# Altium schematic sheet MCU.SchDoc: Title
size A3; Project: Q24 VCU; ENG_APP_DATE: --/--/--; DSN_APP_DATE: --/--/--; CHK_APP_DATE: --/--/--; Date: *******; ApprovedBy: *******; CheckedBy: None; Author: *******; CompanyName: *******; DrawnBy: Jacob Chisholm; Engineer: *******; Organization: *******; Address1: *******; Address2: *******; Address3: *******; Address4: *******; DocumentNumber: 2; Revision: *******; SheetNumber: 2; SheetTotal: 14; Address_Website: https://jchisholm204.github.io; E-Mail: JacobChisholm1010@gmail.com; CurrentTime: *******; CurrentDate: *******; Time: *******; DocumentFullPathAndName: *******; DocumentName: *******; ModifiedDate: *******; ImagePath: *******; ProjectName: *******; Application_BuildNumber: *******
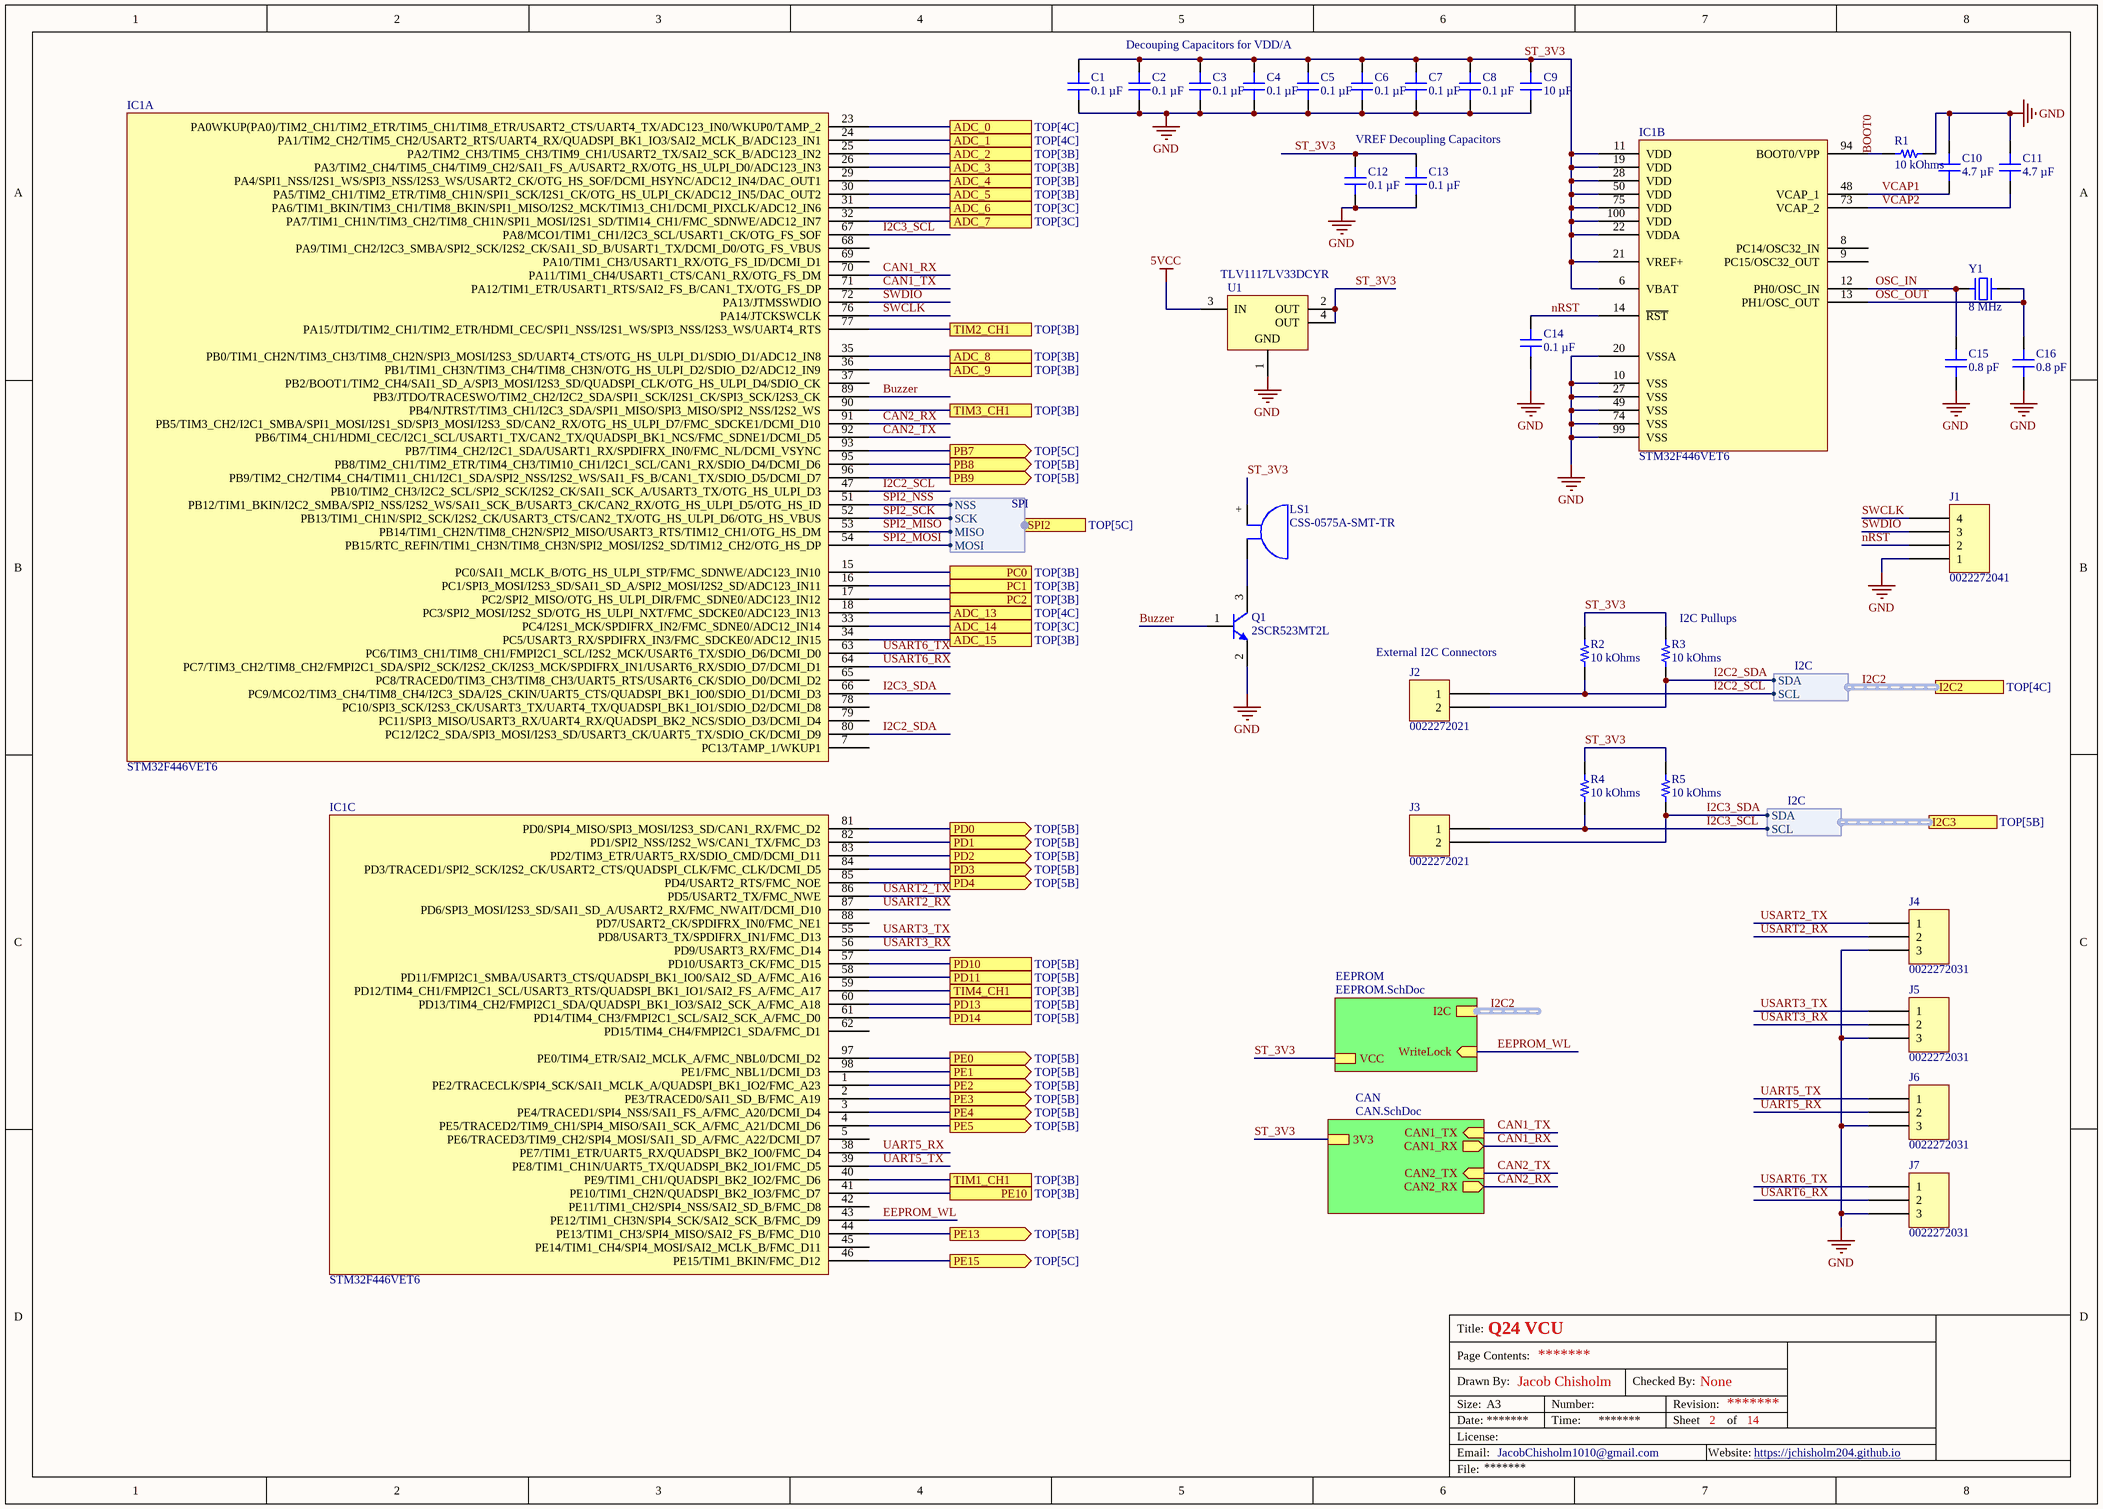
[diagram p0: MCU.SchDoc]

## Parts
C1  0.1 µF  [CAP 0603_1608]
C2  0.1 µF  [CAP 0603_1608]
C3  0.1 µF  [CAP 0603_1608]
C4  0.1 µF  [CAP 0603_1608]
C5  0.1 µF  [CAP 0603_1608]
C6  0.1 µF  [CAP 0603_1608]
C7  0.1 µF  [CAP 0603_1608]
C8  0.1 µF  [CAP 0603_1608]
C9  10 µF  [CAP 0603_1608]
C10  4.7 µF  [CAP 0603_1608]
C11  4.7 µF  [CAP 0603_1608]
C12  0.1 µF  [CAP 0603_1608]
C13  0.1 µF  [CAP 0603_1608]
C14  0.1 µF  [CAP 0603_1608]
C15  0.8 pF  [CAP 0603_1608]
C16  0.8 pF  [CAP 0603_1608]
IC1  STM32F446VET6  [ST LQFP-100 14X14MM]  (parts A,B,C of 3)
J1  0022272041  [MOLEX KK 0022272041]
J2  0022272021  [MOLEX KK 0022272021]
J3  0022272021  [MOLEX KK 0022272021]
J4  0022272031  [MOLEX KK 0022272031]
J5  0022272031  [MOLEX KK 0022272031]
J6  0022272031  [MOLEX KK 0022272031]
J7  0022272031  [MOLEX KK 0022272031]
LS1  CSS-0575A-SMT-TR  [CUI CSS-0575A-SMT-TR]
Q1  2SCR523MT2L  [ROHM SOT-723]
R1  10 kOhms  [RES 0603_1608]
R2  10 kOhms  [RES 0603_1608]
R3  10 kOhms  [RES 0603_1608]
R4  10 kOhms  [RES 0603_1608]
R5  10 kOhms  [RES 0603_1608]
U1  TLV1117LV33DCYR  [DCY0004A_N]
Y1  8 MHz  [NDK NX3225GD]

## Sub-sheets
CAN = CAN.SchDoc: CAN1_TX (in), CAN1_RX (out), CAN2_TX (in), CAN2_RX (out), 3V3
EEPROM = EEPROM.SchDoc: I2C (harness I2C), WriteLock (in), VCC

## Ports
ADC_0 (see TOP[4C]), ADC_1 (see TOP[4C]), ADC_2 (see TOP[3B]), ADC_3 (see TOP[3B]), ADC_4 (see TOP[3B]), ADC_5 (see TOP[3B]), ADC_6 (see TOP[3C]), ADC_7 (see TOP[3C]), ADC_8 (see TOP[3B]), ADC_9 (see TOP[3B]), ADC_13 (see TOP[4C]), ADC_14 (see TOP[3C]), ADC_15 (see TOP[3B]), I2C2 (harness I2C, see TOP[4C]), I2C3 (harness I2C, see TOP[5B]), PB7 (out, see TOP[5C]), PB8 (out, see TOP[5B]), PB9 (out, see TOP[5B]), PC0 (see TOP[3B]), PC1 (see TOP[3B]), PC2 (see TOP[3B]), PD0 (out, see TOP[5B]), PD1 (out, see TOP[5B]), PD2 (out, see TOP[5B]), PD3 (out, see TOP[5B]), PD4 (out, see TOP[5B]), PD10 (see TOP[5B]), PD11 (see TOP[5B]), PD13 (see TOP[5B]), PD14 (see TOP[5B]), PE0 (out, see TOP[5B]), PE1 (out, see TOP[5B]), PE2 (out, see TOP[5B]), PE3 (out, see TOP[5B]), PE4 (out, see TOP[5B]), PE5 (out, see TOP[5B]), PE10 (see TOP[3B]), PE13 (out, see TOP[5B]), PE15 (out, see TOP[5C]), SPI2 (harness SPI, see TOP[5C]), TIM1_CH1 (see TOP[3B]), TIM2_CH1 (see TOP[3B]), TIM3_CH1 (see TOP[3B]), TIM4_CH1 (see TOP[3B])

## Harnesses
SPI: NSS, SCK, MISO, MOSI
I2C: SDA, SCL

## Nets
5VCC: U1.3(IN)
GND: C1.1 C2.1 C3.1 C4.1 C5.1 C6.1 C7.1 C8.1 C9.1 C10.2 C11.2 C12.1 C13.1 C14.1 C15.1 C16.1 IC1.10(VSS) IC1.20(VSSA) IC1.27(VSS) IC1.49(VSS) IC1.74(VSS) IC1.99(VSS) J1.1 J4.3 J5.3 J6.3 J7.3 Q1.2(E) R1.2 U1.1(GND)
ADC_0: IC1.23(PA0WKUP(PA0)/TIM2_CH1/TIM2_ETR/TIM5_CH1/TIM8_ETR/USART2_CTS/UART4_TX/ADC123_IN0/WKUP0/TAMP_2) ; port ADC_0
ADC_1: IC1.24(PA1/TIM2_CH2/TIM5_CH2/USART2_RTS/UART4_RX/QUADSPI_BK1_IO3/SAI2_MCLK_B/ADC123_IN1) ; port ADC_1
ADC_2: IC1.25(PA2/TIM2_CH3/TIM5_CH3/TIM9_CH1/USART2_TX/SAI2_SCK_B/ADC123_IN2) ; port ADC_2
ADC_3: IC1.26(PA3/TIM2_CH4/TIM5_CH4/TIM9_CH2/SAI1_FS_A/USART2_RX/OTG_HS_ULPI_D0/ADC123_IN3) ; port ADC_3
ADC_4: IC1.29(PA4/SPI1_NSS/I2S1_WS/SPI3_NSS/I2S3_WS/USART2_CK/OTG_HS_SOF/DCMI_HSYNC/ADC12_IN4/DAC_OUT1) ; port ADC_4
ADC_5: IC1.30(PA5/TIM2_CH1/TIM2_ETR/TIM8_CH1N/SPI1_SCK/I2S1_CK/OTG_HS_ULPI_CK/ADC12_IN5/DAC_OUT2) ; port ADC_5
ADC_6: IC1.31(PA6/TIM1_BKIN/TIM3_CH1/TIM8_BKIN/SPI1_MISO/I2S2_MCK/TIM13_CH1/DCMI_PIXCLK/ADC12_IN6) ; port ADC_6
ADC_7: IC1.32(PA7/TIM1_CH1N/TIM3_CH2/TIM8_CH1N/SPI1_MOSI/I2S1_SD/TIM14_CH1/FMC_SDNWE/ADC12_IN7) ; port ADC_7
ADC_8: IC1.35(PB0/TIM1_CH2N/TIM3_CH3/TIM8_CH2N/SPI3_MOSI/I2S3_SD/UART4_CTS/OTG_HS_ULPI_D1/SDIO_D1/ADC12_IN8) ; port ADC_8
ADC_9: IC1.36(PB1/TIM1_CH3N/TIM3_CH4/TIM8_CH3N/OTG_HS_ULPI_D2/SDIO_D2/ADC12_IN9) ; port ADC_9
ADC_13: IC1.18(PC3/SPI2_MOSI/I2S2_SD/OTG_HS_ULPI_NXT/FMC_SDCKE0/ADC123_IN13) ; port ADC_13
ADC_14: IC1.33(PC4/I2S1_MCK/SPDIFRX_IN2/FMC_SDNE0/ADC12_IN14) ; port ADC_14
ADC_15: IC1.34(PC5/USART3_RX/SPDIFRX_IN3/FMC_SDCKE0/ADC12_IN15) ; port ADC_15
BOOT0: IC1.94(BOOT0/VPP) R1.1
Buzzer: IC1.89(PB3/JTDO/TRACESWO/TIM2_CH2/I2C2_SDA/SPI1_SCK/I2S1_CK/SPI3_SCK/I2S3_CK) Q1.1(B)
CAN1_RX: IC1.70(PA11/TIM1_CH4/USART1_CTS/CAN1_RX/OTG_FS_DM) ; sheet CAN/CAN1_RX
CAN1_TX: IC1.71(PA12/TIM1_ETR/USART1_RTS/SAI2_FS_B/CAN1_TX/OTG_FS_DP) ; sheet CAN/CAN1_TX
CAN2_RX: IC1.91(PB5/TIM3_CH2/I2C1_SMBA/SPI1_MOSI/I2S1_SD/SPI3_MOSI/I2S3_SD/CAN2_RX/OTG_HS_ULPI_D7/FMC_SDCKE1/DCMI_D10) ; sheet CAN/CAN2_RX
CAN2_TX: IC1.92(PB6/TIM4_CH1/HDMI_CEC/I2C1_SCL/USART1_TX/CAN2_TX/QUADSPI_BK1_NCS/FMC_SDNE1/DCMI_D5) ; sheet CAN/CAN2_TX
EEPROM_WL: IC1.43(PE12/TIM1_CH3N/SPI4_SCK/SAI2_SCK_B/FMC_D9) ; sheet EEPROM/WriteLock
I2C2_SCL: IC1.47(PB10/TIM2_CH3/I2C2_SCL/SPI2_SCK/I2S2_CK/SAI1_SCK_A/USART3_TX/OTG_HS_ULPI_D3) J2.1 R2.1 ; port I2C2.SCL  [project net I2C2.SCL]
I2C2_SDA: IC1.80(PC12/I2C2_SDA/SPI3_MOSI/I2S3_SD/USART3_CK/UART5_TX/SDIO_CK/DCMI_D9) J2.2 R3.1 ; port I2C2.SDA  [project net I2C2.SDA]
I2C3_SCL: IC1.67(PA8/MCO1/TIM1_CH1/I2C3_SCL/USART1_CK/OTG_FS_SOF) J3.1 R4.1 ; port I2C3.SCL
I2C3_SDA: IC1.66(PC9/MCO2/TIM3_CH4/TIM8_CH4/I2C3_SDA/I2S_CKIN/UART5_CTS/QUADSPI_BK1_IO0/SDIO_D1/DCMI_D3) J3.2 R5.1 ; port I2C3.SDA
nRST: C14.2 IC1.14(~{RST}) J1.2
OSC_IN: C15.2 IC1.12(PH0/OSC_IN) Y1.1
OSC_OUT: C16.2 IC1.13(PH1/OSC_OUT) Y1.2
PB7: IC1.93(PB7/TIM4_CH2/I2C1_SDA/USART1_RX/SPDIFRX_IN0/FMC_NL/DCMI_VSYNC) ; port PB7
PB8: IC1.95(PB8/TIM2_CH1/TIM2_ETR/TIM4_CH3/TIM10_CH1/I2C1_SCL/CAN1_RX/SDIO_D4/DCMI_D6) ; port PB8
PB9: IC1.96(PB9/TIM2_CH2/TIM4_CH4/TIM11_CH1/I2C1_SDA/SPI2_NSS/I2S2_WS/SAI1_FS_B/CAN1_TX/SDIO_D5/DCMI_D7) ; port PB9
PC0: IC1.15(PC0/SAI1_MCLK_B/OTG_HS_ULPI_STP/FMC_SDNWE/ADC123_IN10) ; port PC0
PC1: IC1.16(PC1/SPI3_MOSI/I2S3_SD/SAI1_SD_A/SPI2_MOSI/I2S2_SD/ADC123_IN11) ; port PC1
PC2: IC1.17(PC2/SPI2_MISO/OTG_HS_ULPI_DIR/FMC_SDNE0/ADC123_IN12) ; port PC2
PD0: IC1.81(PD0/SPI4_MISO/SPI3_MOSI/I2S3_SD/CAN1_RX/FMC_D2) ; port PD0
PD1: IC1.82(PD1/SPI2_NSS/I2S2_WS/CAN1_TX/FMC_D3) ; port PD1
PD2: IC1.83(PD2/TIM3_ETR/UART5_RX/SDIO_CMD/DCMI_D11) ; port PD2
PD3: IC1.84(PD3/TRACED1/SPI2_SCK/I2S2_CK/USART2_CTS/QUADSPI_CLK/FMC_CLK/DCMI_D5) ; port PD3
PD4: IC1.85(PD4/USART2_RTS/FMC_NOE) ; port PD4
PD10: IC1.57(PD10/USART3_CK/FMC_D15) ; port PD10
PD11: IC1.58(PD11/FMPI2C1_SMBA/USART3_CTS/QUADSPI_BK1_IO0/SAI2_SD_A/FMC_A16) ; port PD11
PD13: IC1.60(PD13/TIM4_CH2/FMPI2C1_SDA/QUADSPI_BK1_IO3/SAI2_SCK_A/FMC_A18) ; port PD13
PD14: IC1.61(PD14/TIM4_CH3/FMPI2C1_SCL/SAI2_SCK_A/FMC_D0) ; port PD14
PE0: IC1.97(PE0/TIM4_ETR/SAI2_MCLK_A/FMC_NBL0/DCMI_D2) ; port PE0
PE1: IC1.98(PE1/FMC_NBL1/DCMI_D3) ; port PE1
PE2: IC1.1(PE2/TRACECLK/SPI4_SCK/SAI1_MCLK_A/QUADSPI_BK1_IO2/FMC_A23) ; port PE2
PE3: IC1.2(PE3/TRACED0/SAI1_SD_B/FMC_A19) ; port PE3
PE4: IC1.3(PE4/TRACED1/SPI4_NSS/SAI1_FS_A/FMC_A20/DCMI_D4) ; port PE4
PE5: IC1.4(PE5/TRACED2/TIM9_CH1/SPI4_MISO/SAI1_SCK_A/FMC_A21/DCMI_D6) ; port PE5
PE10: IC1.41(PE10/TIM1_CH2N/QUADSPI_BK2_IO3/FMC_D7) ; port PE10
PE13: IC1.44(PE13/TIM1_CH3/SPI4_MISO/SAI2_FS_B/FMC_D10) ; port PE13
PE15: IC1.46(PE15/TIM1_BKIN/FMC_D12) ; port PE15
SPI2_MISO: IC1.53(PB14/TIM1_CH2N/TIM8_CH2N/SPI2_MISO/USART3_RTS/TIM12_CH1/OTG_HS_DM) ; port SPI2.MISO
SPI2_MOSI: IC1.54(PB15/RTC_REFIN/TIM1_CH3N/TIM8_CH3N/SPI2_MOSI/I2S2_SD/TIM12_CH2/OTG_HS_DP) ; port SPI2.MOSI
SPI2_NSS: IC1.51(PB12/TIM1_BKIN/I2C2_SMBA/SPI2_NSS/I2S2_WS/SAI1_SCK_B/USART3_CK/CAN2_RX/OTG_HS_ULPI_D5/OTG_HS_ID) ; port SPI2.NSS
SPI2_SCK: IC1.52(PB13/TIM1_CH1N/SPI2_SCK/I2S2_CK/USART3_CTS/CAN2_TX/OTG_HS_ULPI_D6/OTG_HS_VBUS) ; port SPI2.SCK
ST_3V3: C1.2 C2.2 C3.2 C4.2 C5.2 C6.2 C7.2 C8.2 C9.2 C12.2 C13.2 IC1.6(VBAT) IC1.11(VDD) IC1.19(VDD) IC1.21(VREF+) IC1.22(VDDA) IC1.28(VDD) IC1.50(VDD) IC1.75(VDD) IC1.100(VDD) LS1.+ R2.2 R3.2 R4.2 R5.2 U1.2(OUT) U1.4(OUT) ; sheet CAN/3V3, sheet EEPROM/VCC
SWCLK: IC1.76(PA14/JTCKSWCLK) J1.4
SWDIO: IC1.72(PA13/JTMSSWDIO) J1.3
TIM1_CH1: IC1.40(PE9/TIM1_CH1/QUADSPI_BK2_IO2/FMC_D6) ; port TIM1_CH1
TIM2_CH1: IC1.77(PA15/JTDI/TIM2_CH1/TIM2_ETR/HDMI_CEC/SPI1_NSS/I2S1_WS/SPI3_NSS/I2S3_WS/UART4_RTS) ; port TIM2_CH1
TIM3_CH1: IC1.90(PB4/NJTRST/TIM3_CH1/I2C3_SDA/SPI1_MISO/SPI3_MISO/SPI2_NSS/I2S2_WS) ; port TIM3_CH1
TIM4_CH1: IC1.59(PD12/TIM4_CH1/FMPI2C1_SCL/USART3_RTS/QUADSPI_BK1_IO1/SAI2_FS_A/FMC_A17) ; port TIM4_CH1
UART5_RX: IC1.38(PE7/TIM1_ETR/UART5_RX/QUADSPI_BK2_IO0/FMC_D4) J6.2
UART5_TX: IC1.39(PE8/TIM1_CH1N/UART5_TX/QUADSPI_BK2_IO1/FMC_D5) J6.1
USART2_RX: IC1.87(PD6/SPI3_MOSI/I2S3_SD/SAI1_SD_A/USART2_RX/FMC_NWAIT/DCMI_D10) J4.2
USART2_TX: IC1.86(PD5/USART2_TX/FMC_NWE) J4.1
USART3_RX: IC1.56(PD9/USART3_RX/FMC_D14) J5.2
USART3_TX: IC1.55(PD8/USART3_TX/SPDIFRX_IN1/FMC_D13) J5.1
USART6_RX: IC1.64(PC7/TIM3_CH2/TIM8_CH2/FMPI2C1_SDA/SPI2_SCK/I2S2_CK/I2S3_MCK/SPDIFRX_IN1/USART6_RX/SDIO_D7/DCMI_D1) J7.2
USART6_TX: IC1.63(PC6/TIM3_CH1/TIM8_CH1/FMPI2C1_SCL/I2S2_MCK/USART6_TX/SDIO_D6/DCMI_D0) J7.1
VCAP1: C10.1 IC1.48(VCAP_1)
VCAP2: C11.1 IC1.73(VCAP_2)
NetLS1_-: LS1.- Q1.3(C)

Not connected (* = marked no-connect by the designer): IC1 5(PE6/TRACED3/TIM9_CH2/SPI4_MOSI/SAI1_SD_A/FMC_A22/DCMI_D7) 7(PC13/TAMP_1/WKUP1) 8(PC14/OSC32_IN) 9(PC15/OSC32_OUT) 37(PB2/BOOT1/TIM2_CH4/SAI1_SD_A/SPI3_MOSI/I2S3_SD/QUADSPI_CLK/OTG_HS_ULPI_D4/SDIO_CK) 42(PE11/TIM1_CH2/SPI4_NSS/SAI2_SD_B/FMC_D8) 45(PE14/TIM1_CH4/SPI4_MOSI/SAI2_MCLK_B/FMC_D11) 62(PD15/TIM4_CH4/FMPI2C1_SDA/FMC_D1) 65(PC8/TRACED0/TIM3_CH3/TIM8_CH3/UART5_RTS/USART6_CK/SDIO_D0/DCMI_D2) 68(PA9/TIM1_CH2/I2C3_SMBA/SPI2_SCK/I2S2_CK/SAI1_SD_B/USART1_TX/DCMI_D0/OTG_FS_VBUS) 69(PA10/TIM1_CH3/USART1_RX/OTG_FS_ID/DCMI_D1) 78(PC10/SPI3_SCK/I2S3_CK/USART3_TX/UART4_TX/QUADSPI_BK1_IO1/SDIO_D2/DCMI_D8) 79(PC11/SPI3_MISO/USART3_RX/UART4_RX/QUADSPI_BK2_NCS/SDIO_D3/DCMI_D4) 88(PD7/USART2_CK/SPDIFRX_IN0/FMC_NE1)

## Buses and harness runs
harness I2C2 = port I2C2
harness I2C2 = sheet EEPROM/I2C

## Notes on the sheet
- Decouping Capacitors for VDD/A
- VREF Decoupling Capacitors
- (near R3) I2C Pullups
- (near J2) External I2C Connectors
- Title:
- Drawn By:
- Page Contents:
- Checked By:
- Size:
- Date:
- File:
- License:
- Email:
- A3
- Number:
- Time:
- Revision:
- Sheet
- Website:
- of

## Library data of the parts
C1-C8 C12-C14 = 6R3X14W104MV4T: CAP CER 0.1UF 6.3V X7R 0603; manufacturer: Johanson Dielectrics Inc.; Tolerance: ±20%; Part Number: 6R3X14W104MV4T; Value: 0.1 µF; Applications: Bypass, Decoupling; Capacitance: 0.1 µF; componentlink1description: Datasheet; componentlink1url: https://www.johansondielectrics.com/downloads/x2y-filter-and-decoupling-capacitors.pdf; componentlink2description: DigiKey Link; componentlink2url: https://www.digikey.com/en/products/detail/johanson-dielectrics-inc/6R3X14W104MV4T/1556331; Device Package: 0603 (1608 Metric); Features: Low ESL (X2Y); lastupdated: 1/24/2024 8:09:44 PM; Lifecycle Status: Active; Minimum Order: 1; Mounting Type: Surface Mount, MLCC; Operating Temperature: -55°C ~ 125°C; Package / Case: 0603 (1608 Metric); packaging: TapeAndReel; partid: 2650; Part Status: Active; price: 0.08; series: X2Y®; Size / Dimension: 0.064" L x 0.035" W (1.63mm x 0.89mm); Supplier 1: DigiKey; Supplier Part Number 1: 709-1009-1-ND; Temperature Coefficient: X7R; Thickness (Max): 0.026" (0.66mm); Voltage - Rated: 6.3V
C9 = 0603DD106MAT2A: CAP CER 10UF 35V X5R 0603; manufacturer: KYOCERA AVX; Tolerance: ±20%; Part Number: 0603DD106MAT2A; Value: 10 µF; Applications: General Purpose; Capacitance: 10 µF; componentlink2description: DigiKey Link; componentlink2url: https://www.digikey.com/en/products/detail/kyocera-avx/0603DD106MAT2A/16602926; Device Package: 0603 (1608 Metric); lastupdated: 1/24/2024 8:09:02 PM; Lifecycle Status: Active; Minimum Order: 1; Mounting Type: Surface Mount, MLCC; Operating Temperature: -55°C ~ 85°C; Package / Case: 0603 (1608 Metric); packaging: TapeAndReel; partid: 46895; Part Status: Active; price: 0.05; series: -; Size / Dimension: 0.063" L x 0.031" W (1.60mm x 0.80mm); Supplier 1: DigiKey; Supplier Part Number 1: 478-0603DD106MAT2ACT-ND; Temperature Coefficient: X5R; Voltage - Rated: 35V
C10 C11 = 0603X475K6R3CT: CAP CER 4.7UF 6.3V X5R 0603; manufacturer: Walsin Technology Corporation; Tolerance: ±10%; Part Number: 0603X475K6R3CT; Value: 4.7 µF; Applications: General Purpose; Capacitance: 4.7 µF; componentlink1description: Datasheet; componentlink1url: https://www.passivecomponent.com/wp-content/uploads/datasheet/WTC_MLCC_General_Purpose.pdf; componentlink2description: DigiKey Link; componentlink2url: https://www.digikey.com/en/products/detail/walsin-technology-corporation/0603X475K6R3CT/6707555; Device Package: 0603 (1608 Metric); lastupdated: 1/24/2024 8:09:06 PM; Lifecycle Status: Active; Minimum Order: 1; Mounting Type: Surface Mount, MLCC; Operating Temperature: -55°C ~ 85°C; Package / Case: 0603 (1608 Metric); packaging: TapeAndReel; partid: 41179; Part Status: Active; price: 0.04; series: -; Size / Dimension: 0.063" L x 0.032" W (1.60mm x 0.80mm); Supplier 1: DigiKey; Supplier Part Number 1: 1292-0603X475K6R3CT-ND; Temperature Coefficient: X5R; Thickness (Max): 0.039" (1.00mm); Voltage - Rated: 6.3V
C15 C16 = 251R14S0R8BV4T: CAP CER 0.8PF 250V C0G/NP0 0603; manufacturer: Johanson Technology Inc.; Temperature Coefficient: C0G, NP0; Tolerance: ±0.1pF; Part Number: 251R14S0R8BV4T; Value: 0.8 pF; Applications: RF, Microwave, High Frequency; Capacitance: 0.8 pF; componentlink1description: Datasheet; componentlink1url: https://www.johansontechnology.com/downloads/catalog/johanson-technology-multi-layer-high-q-capacitors.pdf; componentlink2description: DigiKey Link; componentlink2url: https://www.digikey.com/en/products/detail/johanson-technology-inc/251R14S0R8BV4T/1561573; Device Package: 0603 (1608 Metric); Features: High Q, Low Loss, Ultra Low ESR; lastupdated: 1/24/2024 8:09:42 PM; Lifecycle Status: Active; Minimum Order: 1; Mounting Type: Surface Mount, MLCC; Operating Temperature: -55°C ~ 125°C; Package / Case: 0603 (1608 Metric); packaging: TapeAndReel; partid: 4851; Part Status: Active; price: 0.03; series: S; Size / Dimension: 0.062" L x 0.032" W (1.57mm x 0.81mm); Supplier 1: DigiKey; Supplier Part Number 1: 712-1305-1-ND; Thickness (Max): 0.035" (0.89mm); Voltage - Rated: 250V
IC1 = STM32F446VET6: IC MCU 32BIT 512KB FLASH 100LQFP; Manufacturer: STMicroelectronics; Connectivity: CANbus, EBI/EMI, I²C, IrDA, LINbus, SAI, SD, SPDIF-Rx, SPI, UART/USART, USB, USB OTG; Core Processor: ARM® Cortex®-M4; Core Size: 32-Bit; Data Converters: A/D 16x12b; D/A 2x12b; Number of I/O: 81; Oscillator Type: Internal; Peripherals: Brown-out Detect/Reset, DMA, I²S, LVD, POR, PWM, WDT; Program Memory Size: 512KB (512K x 8); RAM Size: 128K x 8; Speed: 180MHz; Voltage - Supply (Vcc/Vdd): 1.7V ~ 3.6V; Part Number: STM32F446VET6; ComponentLink1Description: Datasheet; ComponentLink1URL: http://www.st.com/content/ccc/resource/technical/document/datasheet/65/cb/75/50/53/d6/48/24/DM00141306.pdf/files/DM00141306.pdf/jcr:content/translations/en.DM00141306.pdf; ComponentLink2Description: DigiKey Link; ComponentLink2URL: //digikey.com/product-detail/en/stmicroelectronics/STM32F446VET6/497-15375-ND/5175961; Device Package: 100-LQFP; LastUpdated: 12/6/2019 1:21:46 AM; Lifecycle Status: 0; Minimum Order: 1; Mounting Type: Surface Mount; Operating Temperature: -40°C ~ 85°C (TA); Package / Case: 100-LQFP; Packaging: Tray; PartId: 128; Part Status: Active; Price: 8.21; Program Memory Type: FLASH; Series: STM32F4; Supplier 1: DigiKey; Supplier Part Number 1: 497-15375-ND; Supplier Device Package: 100-LQFP (14x14)
J1 = 0022272041: CONN HEADER VERT 4POS 2.54MM; Manufacturer: Molex; Contact Length - Mating: 0.295" (7.49mm); Contact Length - Post: 0.140" (3.56mm); Material Flammability Rating: UL94 V-0; Number of Positions: 4; Number of Positions Loaded: All; Overall Contact Length: 0.560" (14.22mm); Pitch - Mating: 0.100" (2.54mm); Shrouding: Shrouded - 1 Wall; Style: Board to Cable/Wire; Part Number: 0022272041; ComponentLink1Description: Datasheet; ComponentLink1URL: https://www.molex.com/pdm_docs/sd/022272041_sd.pdf; ComponentLink2Description: DigiKey Link; ComponentLink2URL: http://digikey.com/product-detail/en/molex/0022272041/WM4113-ND/1130579; Connector Type: Header; Contact Finish - Mating: Tin; Contact Finish - Post: Tin; Contact Finish Thickness - Mating: 100.0µin (2.54µm); Contact Material: Brass; Contact Shape: Square; Contact Type: Male Pin; Fastening Type: Friction Lock; Insulation Color: Natural; Insulation Height: 0.461" (11.70mm); Insulation Material: Polyamide (PA), Nylon; LastUpdated: 1/12/2020 11:52:05 PM; Lifecycle Status: Active; Minimum Order: 1; Mounting Type: Through Hole; Number of Rows: 1; Packaging: Bulk; PartId: 78; Part Status: Active; Price: 0.40; Series: KK 6410; Supplier 1: DigiKey; Supplier Part Number 1: WM4113-ND; Termination: Solder
J2 J3 = 0022272021: CONN HEADER VERT 2POS 2.54MM; Manufacturer: Molex; Contact Length - Mating: 0.295" (7.49mm); Contact Length - Post: 0.140" (3.56mm); Material Flammability Rating: UL94 V-0; Number of Positions: 2; Number of Positions Loaded: All; Overall Contact Length: 0.560" (14.22mm); Pitch - Mating: 0.100" (2.54mm); Shrouding: Shrouded - 1 Wall; Style: Board to Cable/Wire; Part Number: 0022272021; ComponentLink1Description: Datasheet; ComponentLink1URL: https://www.molex.com/pdm_docs/sd/022272021_sd.pdf; ComponentLink2Description: DigiKey Link; ComponentLink2URL: http://digikey.com/product-detail/en/molex/0022272021/WM4111-ND/1130577; Connector Type: Header; Contact Finish - Mating: Tin; Contact Finish - Post: Tin; Contact Finish Thickness - Mating: 100.0µin (2.54µm); Contact Material: Brass; Contact Shape: Square; Contact Type: Male Pin; Fastening Type: Friction Lock; Insulation Color: Natural; Insulation Height: 0.461" (11.70mm); Insulation Material: Polyamide (PA), Nylon; LastUpdated: 1/12/2020 11:51:43 PM; Lifecycle Status: Active; Minimum Order: 1; Mounting Type: Through Hole; Number of Rows: 1; Packaging: Bulk; PartId: 76; Part Status: Active; Price: 0.27; Series: KK 6410; Supplier 1: DigiKey; Supplier Part Number 1: WM4111-ND; Termination: Solder
J4-J7 = 0022272031: CONN HEADER VERT 3POS 2.54MM; Part Number: 0022272031
LS1 = CSS-0575A-SMT-TR: AUDIO MAGNETIC XDCR 2-4V SMD; Manufacturer: CUI Devices; Current - Supply: 95mA; Driver Circuitry: Transducer, Externally Driven; Frequency: 4kHz; Input Type: Zero-Peak Signal; Operating Mode: Single Tone; Port Location: Top; Sound Pressure Level (SPL): 76dB @ 3V, 10cm; Voltage Range: 2 ~ 4V; Voltage - Rated: 3V; Part Number: CSS-0575A-SMT-TR; ComponentLink1Description: Datasheet; ComponentLink1URL: https://www.cuidevices.com/product/resource/digikeypdf/css-0575a-smt-tr.pdf; ComponentLink2Description: DigiKey Link; ComponentLink2URL: http://digikey.com/product-detail/en/cui-devices/CSS-0575A-SMT-TR/102-2201-1-ND/2364650; Height - Seated (Max): 0.094" (2.40mm); LastUpdated: 4/24/2020 12:39:31 AM; Lifecycle Status: Active; Minimum Order: 1; Mounting Type: Surface Mount; Operating Temperature: -30°C ~ 70°C; Packaging: TapeAndReel; Part Status: Active; Price: 1.50; Series: CSS; Size / Dimension: 0.197" L x 0.197" W (5.00mm x 5.00mm); Supplier 1: DigiKey; Supplier Part Number 1: 102-2201-1-ND; Technology: Magnetic; Termination: Solder Pads
Q1 = 2SCR523MT2L: TRANS NPN 50V 0.1A VMT3; Manufacturer: Rohm Semiconductor; Current - Collector Cutoff (Max): 100nA (ICBO); Current - Collector (Ic) (Max): 100 mA; DC Current Gain (hFE) (Min) @ Ic, Vce: 120 @ 1mA, 6V; Frequency - Transition: 350MHz; Power - Max: 150 mW; Vce Saturation (Max) @ Ib, Ic: 300mV @ 5mA, 50mA; Part Number: 2SCR523MT2L; ComponentLink1Description: Datasheet; ComponentLink1URL: http://rohmfs.rohm.com/en/products/databook/datasheet/discrete/transistor/bipolar/2scr523mt2l-e.pdf; ComponentLink2Description: DigiKey Link; ComponentLink2URL: https://www.digikey.com/en/products/detail/rohm-semiconductor/2SCR523MT2L/5019055; LastUpdated: 2/8/2024 9:53:58 PM; Lifecycle Status: Active; Minimum Order: 1; Mounting Type: Surface Mount; Operating Temperature: 150°C (TJ); Package / Case: SOT-723; Packaging: TapeAndReel; PartId: 1; Part Status: Active; Price: 0.03; Series: -; Supplier 1: DigiKey; Supplier Part Number 1: 2SCR523MT2LCT-ND; Supplier Device Package: VMT3; Transistor Type: NPN; Voltage - Collector Emitter Breakdown (Max): 50 V
R1 = AA0603FR-0710KL: RES SMD 10K OHM 1% 1/10W 0603; Manufacturer: Yageo; Power (Watts): 0.1W, 1/10W; Temperature Coefficient: ±150ppm/°C; Part Number: AA0603FR-0710KL; Value: 10 kOhms; ComponentLink1Description: Datasheet; ComponentLink1URL: https://www.yageo.com/upload/media/product/productsearch/datasheet/rchip/PYu-AA_51_RoHS_L_3.pdf; ComponentLink2Description: DigiKey Link; ComponentLink2URL: https://www.digikey.com/en/products/detail/yageo/AA0603FR-0710KL/5888698; Composition: Thick Film; Device Package: 0603 (1608 Metric); Features: Anti-Sulfur, Automotive AEC-Q200, Moisture Resistant; Height - Seated (Max): 0.022" (0.55mm); LastUpdated: 1/24/2024 8:37:51 PM; Lifecycle Status: Active; Minimum Order: 1; Number of Terminations: 2; Operating Temperature: -55°C ~ 155°C; Package / Case: 0603 (1608 Metric); Packaging: TapeAndReel; PartId: 64302; Part Status: Active; Price: 0.01; Ratings: AEC-Q200; Resistance: 10 kOhms; Series: AA; Size / Dimension: 0.063" L x 0.031" W (1.60mm x 0.80mm); Supplier 1: DigiKey; Supplier Part Number 1: 13-AA0603FR-0710KLCT-ND; Supplier Device Package: 0603; Tolerance: ±1%
R2-R5 = RS73F1JTTD1002B: RES 10K OHM 0.1% 1/5W 0603; Manufacturer: KOA Speer Electronics, Inc.; Power (Watts): 0.2W, 1/5W; Temperature Coefficient: ±25ppm/°C; Part Number: RS73F1JTTD1002B; Value: 10 kOhms; ComponentLink1Description: Datasheet; ComponentLink1URL: http://www.koaspeer.com/pdfs/RS73.pdf; ComponentLink2Description: DigiKey Link; ComponentLink2URL: https://www.digikey.com/en/products/detail/koa-speer-electronics-inc/RS73F1JTTD1002B/11594389; Composition: Thick Film; Device Package: 0603 (1608 Metric); Features: Automotive AEC-Q200, Moisture Resistant; Height - Seated (Max): 0.022" (0.55mm); LastUpdated: 2/9/2024 8:41:42 PM; Lifecycle Status: Active; Minimum Order: 1; Number of Terminations: 2; Operating Temperature: -55°C ~ 155°C; Package / Case: 0603 (1608 Metric); Packaging: TapeAndReel; PartId: 56378; Part Status: Active; Price: 0.07; Ratings: AEC-Q200; Resistance: 10 kOhms; Series: RS73; Size / Dimension: 0.063" L x 0.031" W (1.60mm x 0.80mm); Supplier 1: DigiKey; Supplier Part Number 1: 2019-RS73F1JTTD1002BCT-ND; Supplier Device Package: 0603; Tolerance: ±0.1%
U1 = CMP-0395-00503-2: Single Output LDO, 1 A, Fixed 3.3 V Output, 2 to 5.5 V Input, 4-pin SOT-223 (DCY), -40 to 125 degC, Green (RoHS & no Sb/Br); Manufacturer: Texas Instruments; Vout Adj(Min)(V): 3.3; Vdo(Typ)(mV): 1200; Iq(Typ)(mA): 0.05; Accuracy(%): 2; Iout(Max)(A): 1; SubFamily: Single Channel LDO; Vin(Max)(V): 5.5; PackageReference: DCY0004A; PackageDescription: 4-Pin Plastic Small Outline, Body 3.5 x 6.5 mm, Pitch 2.3 mm; Vout Adj(Max)(V): 3.3; Mounting Technology: Surface Mount; ComponentLink2Description: Datasheet; ComponentLink1Description: Manufacturer URL; PartNumber: TLV1117LV33DCYR; ComponentLink3Description: Package Specification; ComponentLink1URL: http://www.ti.com/; ComponentLink2URL: http://www.ti.com/general/docs/lit/getliterature.tsp?genericPartNumber=TLV1117LV33&fileType=pdf; Fixed Output Options(V): 3.3; PackageVersion: 4202506/B; Vin(Min)(V): 2; DatasheetVersion: SBVS160A; Eco-Plan: Green (RoHS & no Sb/Br); ComponentLink3URL: http://www.ti.com/litv/pdf/mpds094a; Code_JEDEC: TO-261
Y1 = NX3225GD-8MHZ-STD-CRA-3: CRYSTAL 8.0000MHZ 8PF SMD; Manufacturer: NDK America, Inc.; ESR (Equivalent Series Resistance): 500 Ohms; Frequency Stability: ±150ppm; Frequency Tolerance: ±50ppm; Operating Mode: Fundamental; Part Number: NX3225GD-8MHZ-STD-CRA-3; ComponentLink1Description: Datasheet; ComponentLink1URL: http://www.ndk.com/images/products/catalog/c_NX3225GD-STD-CRA-3_e.pdf; ComponentLink2Description: DigiKey Link; ComponentLink2URL: https://www.digikey.com/en/products/detail/ndk-america-inc/NX3225GD-8MHZ-STD-CRA-3/3125637; Frequency: 8 MHz; Height - Seated (Max): 0.039" (1.00mm); LastUpdated: 2/1/2024 9:48:41 PM; Lifecycle Status: Active; Load Capacitance: 8pF; Minimum Order: 1; Mounting Type: Surface Mount; Operating Temperature: -40°C ~ 150°C; Package / Case: 2-SMD, No Lead; Packaging: TapeAndReel; PartId: 744; Part Status: Active; Price: 0.48; Ratings: AEC-Q200; Series: NX3225GD; Size / Dimension: 0.126" L x 0.098" W (3.20mm x 2.50mm); Supplier 1: DigiKey; Supplier Part Number 1: 644-1178-1-ND; Type: MHz Crystal; Value: 8 MHz